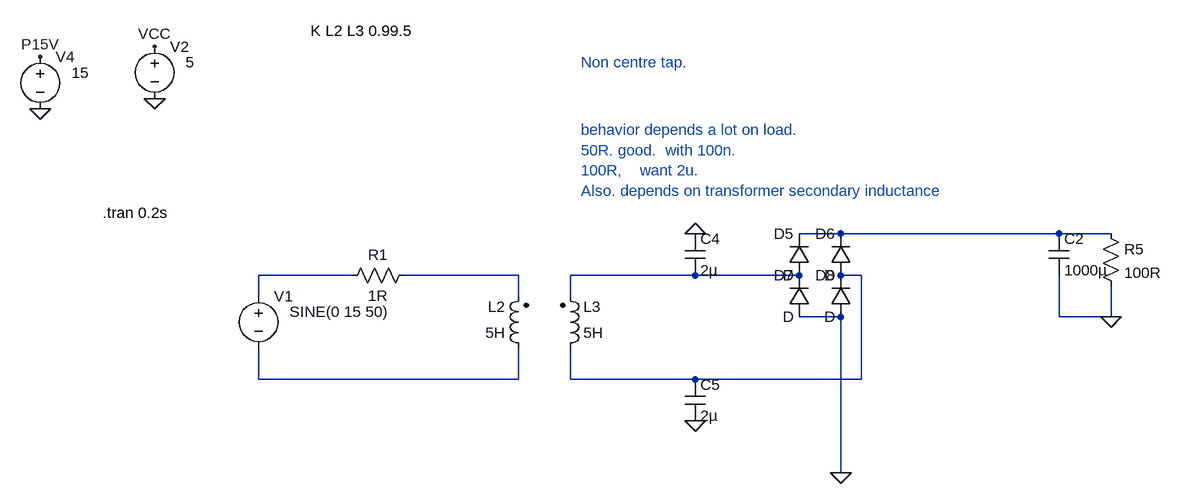
[diagram p0: schematic Draft103.asc]
Draft103.asc, the LTspice schematic file:
Version 4
SHEET 1 5720 1740
WIRE 1840 -144 1776 -144
WIRE 2176 -144 1840 -144
WIRE 2256 -144 2176 -144
WIRE 1088 -80 944 -80
WIRE 1344 -80 1168 -80
WIRE 1616 -80 1424 -80
WIRE 1776 -80 1616 -80
WIRE 1872 -80 1840 -80
WIRE 944 -48 944 -80
WIRE 1344 -48 1344 -80
WIRE 1424 -48 1424 -80
WIRE 1840 -16 1776 -16
WIRE 2176 -16 2176 -80
WIRE 2256 -16 2256 -64
WIRE 2256 -16 2176 -16
WIRE 944 80 944 32
WIRE 1344 80 1344 32
WIRE 1344 80 944 80
WIRE 1424 80 1424 32
WIRE 1616 80 1424 80
WIRE 1872 80 1872 -80
WIRE 1872 80 1616 80
WIRE 1840 224 1840 -16
FLAG 784 -352 0
FLAG 784 -432 VCC
FLAG 608 -336 0
FLAG 608 -416 P15V
FLAG 2256 -16 0
FLAG 1616 -144 0
FLAG 1616 144 0
FLAG 1840 224 0
SYMBOL voltage 784 -448 R0
WINDOW 123 0 0 Left 0
WINDOW 39 0 0 Left 0
WINDOW 3 48 40 Left 2
SYMATTR Value 5
SYMATTR InstName V2
SYMBOL ind2 1408 48 M180
WINDOW 0 36 80 Left 2
WINDOW 3 36 40 Left 2
SYMATTR InstName L3
SYMATTR Value 5H
SYMATTR Type ind
SYMBOL voltage 608 -432 R0
WINDOW 123 0 0 Left 0
WINDOW 39 0 0 Left 0
WINDOW 3 48 40 Left 2
SYMATTR Value 15
SYMATTR InstName V4
SYMBOL ind2 1360 48 R180
WINDOW 0 36 80 Left 2
WINDOW 3 36 40 Left 2
SYMATTR InstName L2
SYMATTR Value 5H
SYMATTR Type ind
SYMBOL diode 1792 -80 R180
WINDOW 0 24 64 Left 2
WINDOW 3 24 0 Left 2
SYMATTR InstName D5
SYMBOL diode 1856 -80 R180
WINDOW 0 24 64 Left 2
WINDOW 3 24 0 Left 2
SYMATTR InstName D6
SYMBOL diode 1792 -16 R180
WINDOW 0 24 64 Left 2
WINDOW 3 24 0 Left 2
SYMATTR InstName D7
SYMBOL diode 1856 -16 R180
WINDOW 0 24 64 Left 2
WINDOW 3 24 0 Left 2
SYMATTR InstName D8
SYMBOL cap 2160 -144 R0
SYMATTR InstName C2
SYMATTR Value 1000µ
SYMBOL res 2240 -160 R0
SYMATTR InstName R5
SYMATTR Value 100R
SYMBOL voltage 944 -64 R0
WINDOW 123 0 0 Left 0
WINDOW 39 0 0 Left 0
WINDOW 3 48 40 Left 2
SYMATTR Value SINE(0 15 50)
SYMATTR InstName V1
SYMBOL res 1184 -96 R90
WINDOW 0 0 56 VBottom 2
WINDOW 3 32 56 VTop 2
SYMATTR InstName R1
SYMATTR Value 1R
SYMBOL cap 1600 -144 R0
SYMATTR InstName C4
SYMATTR Value 2µ
SYMBOL cap 1600 80 R0
SYMATTR InstName C5
SYMATTR Value 2µ
TEXT 1024 -456 Left 2 !K L2 L3 0.99.5
TEXT 704 -176 Left 2 !.tran 0.2s
TEXT 1440 -304 Left 2 ;behavior depends a lot on load. \n50R. good.  with 100n. \n100R,    want 2u.\nAlso. depends on transformer secondary inductance
TEXT 1440 -408 Left 2 ;Non centre tap.

The netlist it stands for:
* Draft103.asc
V2 VCC 0 5
L3 N005 N004 5H
V4 P15V 0 15
L2 N006 N003 5H
D5 N004 N001 D
D6 N005 N001 D
D7 0 N004 D
D8 0 N005 D
C2 N001 0 1000µ
R5 N001 0 100R
V1 N002 N006 SINE(0 15 50)
R1 N003 N002 1R
C4 0 N004 2µ
C5 N005 0 2µ
.model D D
.lib standard.dio
K L2 L3 0.99.5
.tran 0.2s
* behavior depends a lot on load.
* 50R. good.  with 100n.
* 100R,    want 2u.
* Also. depends on transformer secondary inductance
* Non centre tap.
.backanno
.end